# Altium schematic sheet GS_01_Pow.SchDoc: Title
size A3; Date: Date; CompanyName: Integrated Micro-Electronics Bulgaria; Organization: Design & Development Department; Address1: Drawing Type; Address2: Address 1; Address3: Address 2; Address4: Address 3; DocumentNumber: 730xxx; Revision: 01; SheetNumber: 1; SheetTotal: 1; PageSetup: Record=PageOptions|CenterHorizontal=True|CenterVertical=True|PrintScale=0.70|XCorrection=1.00|YCorrection=1.00|PrintKind=2|BorderSize=5000000|LeftOffset=0|BottomOffset=0|Orientation=2|PaperLength=1000|PaperWidth=1000|Scale=100|PaperSource=7|PrintQuality=-4|MediaType=1|DitherType=10|PaperKind=A4|PrintScaleMode=1; SheetSize: A3; Time: Time; ModifiedDate: Mod. Date
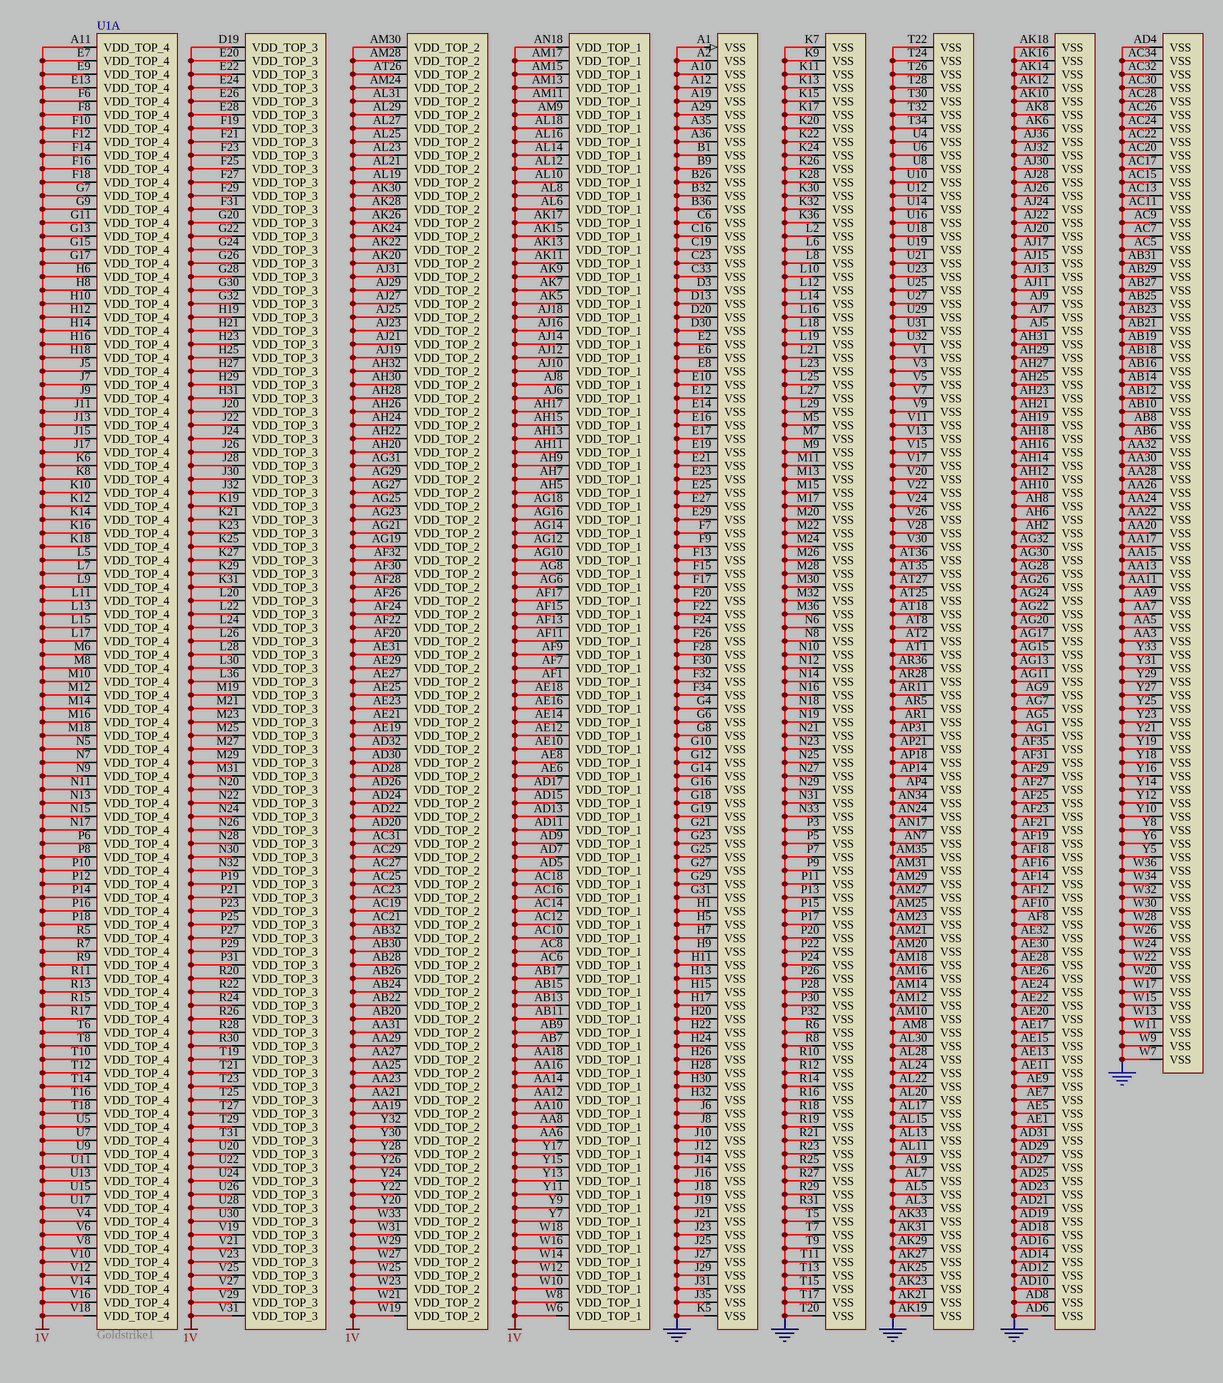
[diagram p0: GS_01_Pow.SchDoc]

## Parts
U1  Goldstrike1  (part A of 5)

## Nets
1V: U1.A11(VDD_TOP_4) U1.AA6(VDD_TOP_1) U1.AA8(VDD_TOP_1) U1.AA10(VDD_TOP_1) U1.AA12(VDD_TOP_1) U1.AA14(VDD_TOP_1) U1.AA16(VDD_TOP_1) U1.AA18(VDD_TOP_1) U1.AA19(VDD_TOP_2) U1.AA21(VDD_TOP_2) U1.AA23(VDD_TOP_2) U1.AA25(VDD_TOP_2) U1.AA27(VDD_TOP_2) U1.AA29(VDD_TOP_2) U1.AA31(VDD_TOP_2) U1.AB7(VDD_TOP_1) U1.AB9(VDD_TOP_1) U1.AB11(VDD_TOP_1) U1.AB13(VDD_TOP_1) U1.AB15(VDD_TOP_1) U1.AB17(VDD_TOP_1) U1.AB20(VDD_TOP_2) U1.AB22(VDD_TOP_2) U1.AB24(VDD_TOP_2) U1.AB26(VDD_TOP_2) U1.AB28(VDD_TOP_2) U1.AB30(VDD_TOP_2) U1.AB32(VDD_TOP_2) U1.AC6(VDD_TOP_1) U1.AC8(VDD_TOP_1) U1.AC10(VDD_TOP_1) U1.AC12(VDD_TOP_1) U1.AC14(VDD_TOP_1) U1.AC16(VDD_TOP_1) U1.AC18(VDD_TOP_1) U1.AC19(VDD_TOP_2) U1.AC21(VDD_TOP_2) U1.AC23(VDD_TOP_2) U1.AC25(VDD_TOP_2) U1.AC27(VDD_TOP_2) U1.AC29(VDD_TOP_2) U1.AC31(VDD_TOP_2) U1.AD5(VDD_TOP_1) U1.AD7(VDD_TOP_1) U1.AD9(VDD_TOP_1) U1.AD11(VDD_TOP_1) U1.AD13(VDD_TOP_1) U1.AD15(VDD_TOP_1) U1.AD17(VDD_TOP_1) U1.AD20(VDD_TOP_2) U1.AD22(VDD_TOP_2) U1.AD24(VDD_TOP_2) U1.AD26(VDD_TOP_2) U1.AD28(VDD_TOP_2) U1.AD30(VDD_TOP_2) U1.AD32(VDD_TOP_2) U1.AE6(VDD_TOP_1) U1.AE8(VDD_TOP_1) U1.AE10(VDD_TOP_1) U1.AE12(VDD_TOP_1) U1.AE14(VDD_TOP_1) U1.AE16(VDD_TOP_1) U1.AE18(VDD_TOP_1) U1.AE19(VDD_TOP_2) U1.AE21(VDD_TOP_2) U1.AE23(VDD_TOP_2) U1.AE25(VDD_TOP_2) U1.AE27(VDD_TOP_2) U1.AE29(VDD_TOP_2) U1.AE31(VDD_TOP_2) U1.AF1(VDD_TOP_1) U1.AF7(VDD_TOP_1) U1.AF9(VDD_TOP_1) U1.AF11(VDD_TOP_1) U1.AF13(VDD_TOP_1) U1.AF15(VDD_TOP_1) U1.AF17(VDD_TOP_1) U1.AF20(VDD_TOP_2) U1.AF22(VDD_TOP_2) U1.AF24(VDD_TOP_2) U1.AF26(VDD_TOP_2) U1.AF28(VDD_TOP_2) U1.AF30(VDD_TOP_2) U1.AF32(VDD_TOP_2) U1.AG6(VDD_TOP_1) U1.AG8(VDD_TOP_1) U1.AG10(VDD_TOP_1) U1.AG12(VDD_TOP_1) U1.AG14(VDD_TOP_1) U1.AG16(VDD_TOP_1) U1.AG18(VDD_TOP_1) U1.AG19(VDD_TOP_2) U1.AG21(VDD_TOP_2) U1.AG23(VDD_TOP_2) U1.AG25(VDD_TOP_2) U1.AG27(VDD_TOP_2) U1.AG29(VDD_TOP_2) U1.AG31(VDD_TOP_2) U1.AH5(VDD_TOP_1) U1.AH7(VDD_TOP_1) U1.AH9(VDD_TOP_1) U1.AH11(VDD_TOP_1) U1.AH13(VDD_TOP_1) U1.AH15(VDD_TOP_1) U1.AH17(VDD_TOP_1) U1.AH20(VDD_TOP_2) U1.AH22(VDD_TOP_2) U1.AH24(VDD_TOP_2) U1.AH26(VDD_TOP_2) U1.AH28(VDD_TOP_2) U1.AH30(VDD_TOP_2) U1.AH32(VDD_TOP_2) U1.AJ6(VDD_TOP_1) U1.AJ8(VDD_TOP_1) U1.AJ10(VDD_TOP_1) U1.AJ12(VDD_TOP_1) U1.AJ14(VDD_TOP_1) U1.AJ16(VDD_TOP_1) U1.AJ18(VDD_TOP_1) U1.AJ19(VDD_TOP_2) U1.AJ21(VDD_TOP_2) U1.AJ23(VDD_TOP_2) U1.AJ25(VDD_TOP_2) U1.AJ27(VDD_TOP_2) U1.AJ29(VDD_TOP_2) U1.AJ31(VDD_TOP_2) U1.AK5(VDD_TOP_1) U1.AK7(VDD_TOP_1) U1.AK9(VDD_TOP_1) U1.AK11(VDD_TOP_1) U1.AK13(VDD_TOP_1) U1.AK15(VDD_TOP_1) U1.AK17(VDD_TOP_1) U1.AK20(VDD_TOP_2) U1.AK22(VDD_TOP_2) U1.AK24(VDD_TOP_2) U1.AK26(VDD_TOP_2) U1.AK28(VDD_TOP_2) U1.AK30(VDD_TOP_2) U1.AL6(VDD_TOP_1) U1.AL8(VDD_TOP_1) U1.AL10(VDD_TOP_1) U1.AL12(VDD_TOP_1) U1.AL14(VDD_TOP_1) U1.AL16(VDD_TOP_1) U1.AL18(VDD_TOP_1) U1.AL19(VDD_TOP_2) U1.AL21(VDD_TOP_2) U1.AL23(VDD_TOP_2) U1.AL25(VDD_TOP_2) U1.AL27(VDD_TOP_2) U1.AL29(VDD_TOP_2) U1.AL31(VDD_TOP_2) U1.AM9(VDD_TOP_1) U1.AM11(VDD_TOP_1) U1.AM13(VDD_TOP_1) U1.AM15(VDD_TOP_1) U1.AM17(VDD_TOP_1) U1.AM24(VDD_TOP_2) U1.AM28(VDD_TOP_2) U1.AM30(VDD_TOP_2) U1.AN18(VDD_TOP_1) U1.AT26(VDD_TOP_2) U1.D19(VDD_TOP_3) U1.E7(VDD_TOP_4) U1.E9(VDD_TOP_4) U1.E13(VDD_TOP_4) U1.E20(VDD_TOP_3) U1.E22(VDD_TOP_3) U1.E24(VDD_TOP_3) U1.E26(VDD_TOP_3) U1.E28(VDD_TOP_3) U1.F6(VDD_TOP_4) U1.F8(VDD_TOP_4) U1.F10(VDD_TOP_4) U1.F12(VDD_TOP_4) U1.F14(VDD_TOP_4) U1.F16(VDD_TOP_4) U1.F18(VDD_TOP_4) U1.F19(VDD_TOP_3) U1.F21(VDD_TOP_3) U1.F23(VDD_TOP_3) U1.F25(VDD_TOP_3) U1.F27(VDD_TOP_3) U1.F29(VDD_TOP_3) U1.F31(VDD_TOP_3) U1.G7(VDD_TOP_4) U1.G9(VDD_TOP_4) U1.G11(VDD_TOP_4) U1.G13(VDD_TOP_4) U1.G15(VDD_TOP_4) U1.G17(VDD_TOP_4) U1.G20(VDD_TOP_3) U1.G22(VDD_TOP_3) U1.G24(VDD_TOP_3) U1.G26(VDD_TOP_3) U1.G28(VDD_TOP_3) U1.G30(VDD_TOP_3) U1.G32(VDD_TOP_3) U1.H6(VDD_TOP_4) U1.H8(VDD_TOP_4) U1.H10(VDD_TOP_4) U1.H12(VDD_TOP_4) U1.H14(VDD_TOP_4) U1.H16(VDD_TOP_4) U1.H18(VDD_TOP_4) U1.H19(VDD_TOP_3) U1.H21(VDD_TOP_3) U1.H23(VDD_TOP_3) U1.H25(VDD_TOP_3) U1.H27(VDD_TOP_3) U1.H29(VDD_TOP_3) U1.H31(VDD_TOP_3) U1.J5(VDD_TOP_4) U1.J7(VDD_TOP_4) U1.J9(VDD_TOP_4) U1.J11(VDD_TOP_4) U1.J13(VDD_TOP_4) U1.J15(VDD_TOP_4) U1.J17(VDD_TOP_4) U1.J20(VDD_TOP_3) U1.J22(VDD_TOP_3) U1.J24(VDD_TOP_3) U1.J26(VDD_TOP_3) U1.J28(VDD_TOP_3) U1.J30(VDD_TOP_3) U1.J32(VDD_TOP_3) U1.K6(VDD_TOP_4) U1.K8(VDD_TOP_4) U1.K10(VDD_TOP_4) U1.K12(VDD_TOP_4) U1.K14(VDD_TOP_4) U1.K16(VDD_TOP_4) U1.K18(VDD_TOP_4) U1.K19(VDD_TOP_3) U1.K21(VDD_TOP_3) U1.K23(VDD_TOP_3) U1.K25(VDD_TOP_3) U1.K27(VDD_TOP_3) U1.K29(VDD_TOP_3) U1.K31(VDD_TOP_3) U1.L5(VDD_TOP_4) U1.L7(VDD_TOP_4) U1.L9(VDD_TOP_4) U1.L11(VDD_TOP_4) U1.L13(VDD_TOP_4) U1.L15(VDD_TOP_4) U1.L17(VDD_TOP_4) U1.L20(VDD_TOP_3) U1.L22(VDD_TOP_3) U1.L24(VDD_TOP_3) U1.L26(VDD_TOP_3) U1.L28(VDD_TOP_3) U1.L30(VDD_TOP_3) U1.L36(VDD_TOP_3) U1.M6(VDD_TOP_4) U1.M8(VDD_TOP_4) U1.M10(VDD_TOP_4) U1.M12(VDD_TOP_4) U1.M14(VDD_TOP_4) U1.M16(VDD_TOP_4) U1.M18(VDD_TOP_4) U1.M19(VDD_TOP_3) U1.M21(VDD_TOP_3) U1.M23(VDD_TOP_3) U1.M25(VDD_TOP_3) U1.M27(VDD_TOP_3) U1.M29(VDD_TOP_3) U1.M31(VDD_TOP_3) U1.N5(VDD_TOP_4) U1.N7(VDD_TOP_4) U1.N9(VDD_TOP_4) U1.N11(VDD_TOP_4) U1.N13(VDD_TOP_4) U1.N15(VDD_TOP_4) U1.N17(VDD_TOP_4) U1.N20(VDD_TOP_3) U1.N22(VDD_TOP_3) U1.N24(VDD_TOP_3) U1.N26(VDD_TOP_3) U1.N28(VDD_TOP_3) U1.N30(VDD_TOP_3) U1.N32(VDD_TOP_3) U1.P6(VDD_TOP_4) U1.P8(VDD_TOP_4) U1.P10(VDD_TOP_4) U1.P12(VDD_TOP_4) U1.P14(VDD_TOP_4) U1.P16(VDD_TOP_4) U1.P18(VDD_TOP_4) U1.P19(VDD_TOP_3) U1.P21(VDD_TOP_3) U1.P23(VDD_TOP_3) U1.P25(VDD_TOP_3) U1.P27(VDD_TOP_3) U1.P29(VDD_TOP_3) U1.P31(VDD_TOP_3) U1.R5(VDD_TOP_4) U1.R7(VDD_TOP_4) U1.R9(VDD_TOP_4) U1.R11(VDD_TOP_4) U1.R13(VDD_TOP_4) U1.R15(VDD_TOP_4) U1.R17(VDD_TOP_4) U1.R20(VDD_TOP_3) U1.R22(VDD_TOP_3) U1.R24(VDD_TOP_3) U1.R26(VDD_TOP_3) U1.R28(VDD_TOP_3) U1.R30(VDD_TOP_3) U1.T6(VDD_TOP_4) U1.T8(VDD_TOP_4) U1.T10(VDD_TOP_4) U1.T12(VDD_TOP_4) U1.T14(VDD_TOP_4) U1.T16(VDD_TOP_4) U1.T18(VDD_TOP_4) U1.T19(VDD_TOP_3) U1.T21(VDD_TOP_3) U1.T23(VDD_TOP_3) U1.T25(VDD_TOP_3) U1.T27(VDD_TOP_3) U1.T29(VDD_TOP_3) U1.T31(VDD_TOP_3) U1.U5(VDD_TOP_4) U1.U7(VDD_TOP_4) U1.U9(VDD_TOP_4) U1.U11(VDD_TOP_4) U1.U13(VDD_TOP_4) U1.U15(VDD_TOP_4) U1.U17(VDD_TOP_4) U1.U20(VDD_TOP_3) U1.U22(VDD_TOP_3) U1.U24(VDD_TOP_3) U1.U26(VDD_TOP_3) U1.U28(VDD_TOP_3) U1.U30(VDD_TOP_3) U1.V4(VDD_TOP_4) U1.V6(VDD_TOP_4) U1.V8(VDD_TOP_4) U1.V10(VDD_TOP_4) U1.V12(VDD_TOP_4) U1.V14(VDD_TOP_4) U1.V16(VDD_TOP_4) U1.V18(VDD_TOP_4) U1.V19(VDD_TOP_3) U1.V21(VDD_TOP_3) U1.V23(VDD_TOP_3) U1.V25(VDD_TOP_3) U1.V27(VDD_TOP_3) U1.V29(VDD_TOP_3) U1.V31(VDD_TOP_3) U1.W6(VDD_TOP_1) U1.W8(VDD_TOP_1) U1.W10(VDD_TOP_1) U1.W12(VDD_TOP_1) U1.W14(VDD_TOP_1) U1.W16(VDD_TOP_1) U1.W18(VDD_TOP_1) U1.W19(VDD_TOP_2) U1.W21(VDD_TOP_2) U1.W23(VDD_TOP_2) U1.W25(VDD_TOP_2) U1.W27(VDD_TOP_2) U1.W29(VDD_TOP_2) U1.W31(VDD_TOP_2) U1.W33(VDD_TOP_2) U1.Y7(VDD_TOP_1) U1.Y9(VDD_TOP_1) U1.Y11(VDD_TOP_1) U1.Y13(VDD_TOP_1) U1.Y15(VDD_TOP_1) U1.Y17(VDD_TOP_1) U1.Y20(VDD_TOP_2) U1.Y22(VDD_TOP_2) U1.Y24(VDD_TOP_2) U1.Y26(VDD_TOP_2) U1.Y28(VDD_TOP_2) U1.Y30(VDD_TOP_2) U1.Y32(VDD_TOP_2)
GND: U1.A1(VSS) U1.A2(VSS) U1.A10(VSS) U1.A12(VSS) U1.A19(VSS) U1.A29(VSS) U1.A35(VSS) U1.A36(VSS) U1.AA3(VSS) U1.AA5(VSS) U1.AA7(VSS) U1.AA9(VSS) U1.AA11(VSS) U1.AA13(VSS) U1.AA15(VSS) U1.AA17(VSS) U1.AA20(VSS) U1.AA22(VSS) U1.AA24(VSS) U1.AA26(VSS) U1.AA28(VSS) U1.AA30(VSS) U1.AA32(VSS) U1.AB6(VSS) U1.AB8(VSS) U1.AB10(VSS) U1.AB12(VSS) U1.AB14(VSS) U1.AB16(VSS) U1.AB18(VSS) U1.AB19(VSS) U1.AB21(VSS) U1.AB23(VSS) U1.AB25(VSS) U1.AB27(VSS) U1.AB29(VSS) U1.AB31(VSS) U1.AC5(VSS) U1.AC7(VSS) U1.AC9(VSS) U1.AC11(VSS) U1.AC13(VSS) U1.AC15(VSS) U1.AC17(VSS) U1.AC20(VSS) U1.AC22(VSS) U1.AC24(VSS) U1.AC26(VSS) U1.AC28(VSS) U1.AC30(VSS) U1.AC32(VSS) U1.AC34(VSS) U1.AD4(VSS) U1.AD6(VSS) U1.AD8(VSS) U1.AD10(VSS) U1.AD12(VSS) U1.AD14(VSS) U1.AD16(VSS) U1.AD18(VSS) U1.AD19(VSS) U1.AD21(VSS) U1.AD23(VSS) U1.AD25(VSS) U1.AD27(VSS) U1.AD29(VSS) U1.AD31(VSS) U1.AE1(VSS) U1.AE5(VSS) U1.AE7(VSS) U1.AE9(VSS) U1.AE11(VSS) U1.AE13(VSS) U1.AE15(VSS) U1.AE17(VSS) U1.AE20(VSS) U1.AE22(VSS) U1.AE24(VSS) U1.AE26(VSS) U1.AE28(VSS) U1.AE30(VSS) U1.AE32(VSS) U1.AF8(VSS) U1.AF10(VSS) U1.AF12(VSS) U1.AF14(VSS) U1.AF16(VSS) U1.AF18(VSS) U1.AF19(VSS) U1.AF21(VSS) U1.AF23(VSS) U1.AF25(VSS) U1.AF27(VSS) U1.AF29(VSS) U1.AF31(VSS) U1.AF35(VSS) U1.AG1(VSS) U1.AG5(VSS) U1.AG7(VSS) U1.AG9(VSS) U1.AG11(VSS) U1.AG13(VSS) U1.AG15(VSS) U1.AG17(VSS) U1.AG20(VSS) U1.AG22(VSS) U1.AG24(VSS) U1.AG26(VSS) U1.AG28(VSS) U1.AG30(VSS) U1.AG32(VSS) U1.AH2(VSS) U1.AH6(VSS) U1.AH8(VSS) U1.AH10(VSS) U1.AH12(VSS) U1.AH14(VSS) U1.AH16(VSS) U1.AH18(VSS) U1.AH19(VSS) U1.AH21(VSS) U1.AH23(VSS) U1.AH25(VSS) U1.AH27(VSS) U1.AH29(VSS) U1.AH31(VSS) U1.AJ5(VSS) U1.AJ7(VSS) U1.AJ9(VSS) U1.AJ11(VSS) U1.AJ13(VSS) U1.AJ15(VSS) U1.AJ17(VSS) U1.AJ20(VSS) U1.AJ22(VSS) U1.AJ24(VSS) U1.AJ26(VSS) U1.AJ28(VSS) U1.AJ30(VSS) U1.AJ32(VSS) U1.AJ36(VSS) U1.AK6(VSS) U1.AK8(VSS) U1.AK10(VSS) U1.AK12(VSS) U1.AK14(VSS) U1.AK16(VSS) U1.AK18(VSS) U1.AK19(VSS) U1.AK21(VSS) U1.AK23(VSS) U1.AK25(VSS) U1.AK27(VSS) U1.AK29(VSS) U1.AK31(VSS) U1.AK33(VSS) U1.AL3(VSS) U1.AL5(VSS) U1.AL7(VSS) U1.AL9(VSS) U1.AL11(VSS) U1.AL13(VSS) U1.AL15(VSS) U1.AL17(VSS) U1.AL20(VSS) U1.AL22(VSS) U1.AL24(VSS) U1.AL28(VSS) U1.AL30(VSS) U1.AM8(VSS) U1.AM10(VSS) U1.AM12(VSS) U1.AM14(VSS) U1.AM16(VSS) U1.AM18(VSS) U1.AM20(VSS) U1.AM21(VSS) U1.AM23(VSS) U1.AM25(VSS) U1.AM27(VSS) U1.AM29(VSS) U1.AM31(VSS) U1.AM35(VSS) U1.AN7(VSS) U1.AN17(VSS) U1.AN24(VSS) U1.AN34(VSS) U1.AP4(VSS) U1.AP14(VSS) U1.AP18(VSS) U1.AP21(VSS) U1.AP31(VSS) U1.AR1(VSS) U1.AR5(VSS) U1.AR11(VSS) U1.AR28(VSS) U1.AR36(VSS) U1.AT1(VSS) U1.AT2(VSS) U1.AT8(VSS) U1.AT18(VSS) U1.AT25(VSS) U1.AT27(VSS) U1.AT35(VSS) U1.AT36(VSS) U1.B1(VSS) U1.B9(VSS) U1.B26(VSS) U1.B32(VSS) U1.B36(VSS) U1.C6(VSS) U1.C16(VSS) U1.C19(VSS) U1.C23(VSS) U1.C33(VSS) U1.D3(VSS) U1.D13(VSS) U1.D20(VSS) U1.D30(VSS) U1.E2(VSS) U1.E6(VSS) U1.E8(VSS) U1.E10(VSS) U1.E12(VSS) U1.E14(VSS) U1.E16(VSS) U1.E17(VSS) U1.E19(VSS) U1.E21(VSS) U1.E23(VSS) U1.E25(VSS) U1.E27(VSS) U1.E29(VSS) U1.F7(VSS) U1.F9(VSS) U1.F13(VSS) U1.F15(VSS) U1.F17(VSS) U1.F20(VSS) U1.F22(VSS) U1.F24(VSS) U1.F26(VSS) U1.F28(VSS) U1.F30(VSS) U1.F32(VSS) U1.F34(VSS) U1.G4(VSS) U1.G6(VSS) U1.G8(VSS) U1.G10(VSS) U1.G12(VSS) U1.G14(VSS) U1.G16(VSS) U1.G18(VSS) U1.G19(VSS) U1.G21(VSS) U1.G23(VSS) U1.G25(VSS) U1.G27(VSS) U1.G29(VSS) U1.G31(VSS) U1.H1(VSS) U1.H5(VSS) U1.H7(VSS) U1.H9(VSS) U1.H11(VSS) U1.H13(VSS) U1.H15(VSS) U1.H17(VSS) U1.H20(VSS) U1.H22(VSS) U1.H24(VSS) U1.H26(VSS) U1.H28(VSS) U1.H30(VSS) U1.H32(VSS) U1.J6(VSS) U1.J8(VSS) U1.J10(VSS) U1.J12(VSS) U1.J14(VSS) U1.J16(VSS) U1.J18(VSS) U1.J19(VSS) U1.J21(VSS) U1.J23(VSS) U1.J25(VSS) U1.J27(VSS) U1.J29(VSS) U1.J31(VSS) U1.J35(VSS) U1.K5(VSS) U1.K7(VSS) U1.K9(VSS) U1.K11(VSS) U1.K13(VSS) U1.K15(VSS) U1.K17(VSS) U1.K20(VSS) U1.K22(VSS) U1.K24(VSS) U1.K26(VSS) U1.K28(VSS) U1.K30(VSS) U1.K32(VSS) U1.K36(VSS) U1.L2(VSS) U1.L6(VSS) U1.L8(VSS) U1.L10(VSS) U1.L12(VSS) U1.L14(VSS) U1.L16(VSS) U1.L18(VSS) U1.L19(VSS) U1.L21(VSS) U1.L23(VSS) U1.L25(VSS) U1.L27(VSS) U1.L29(VSS) U1.M5(VSS) U1.M7(VSS) U1.M9(VSS) U1.M11(VSS) U1.M13(VSS) U1.M15(VSS) U1.M17(VSS) U1.M20(VSS) U1.M22(VSS) U1.M24(VSS) U1.M26(VSS) U1.M28(VSS) U1.M30(VSS) U1.M32(VSS) U1.M36(VSS) U1.N6(VSS) U1.N8(VSS) U1.N10(VSS) U1.N12(VSS) U1.N14(VSS) U1.N16(VSS) U1.N18(VSS) U1.N19(VSS) U1.N21(VSS) U1.N23(VSS) U1.N25(VSS) U1.N27(VSS) U1.N29(VSS) U1.N31(VSS) U1.N33(VSS) U1.P3(VSS) U1.P5(VSS) U1.P7(VSS) U1.P9(VSS) U1.P11(VSS) U1.P13(VSS) U1.P15(VSS) U1.P17(VSS) U1.P20(VSS) U1.P22(VSS) U1.P24(VSS) U1.P26(VSS) U1.P28(VSS) U1.P30(VSS) U1.P32(VSS) U1.R6(VSS) U1.R8(VSS) U1.R10(VSS) U1.R12(VSS) U1.R14(VSS) U1.R16(VSS) U1.R18(VSS) U1.R19(VSS) U1.R21(VSS) U1.R23(VSS) U1.R25(VSS) U1.R27(VSS) U1.R29(VSS) U1.R31(VSS) U1.T5(VSS) U1.T7(VSS) U1.T9(VSS) U1.T11(VSS) U1.T13(VSS) U1.T15(VSS) U1.T17(VSS) U1.T20(VSS) U1.T22(VSS) U1.T24(VSS) U1.T26(VSS) U1.T28(VSS) U1.T30(VSS) U1.T32(VSS) U1.T34(VSS) U1.U4(VSS) U1.U6(VSS) U1.U8(VSS) U1.U10(VSS) U1.U12(VSS) U1.U14(VSS) U1.U16(VSS) U1.U18(VSS) U1.U19(VSS) U1.U21(VSS) U1.U23(VSS) U1.U25(VSS) U1.U27(VSS) U1.U29(VSS) U1.U31(VSS) U1.U32(VSS) U1.V1(VSS) U1.V3(VSS) U1.V5(VSS) U1.V7(VSS) U1.V9(VSS) U1.V11(VSS) U1.V13(VSS) U1.V15(VSS) U1.V17(VSS) U1.V20(VSS) U1.V22(VSS) U1.V24(VSS) U1.V26(VSS) U1.V28(VSS) U1.V30(VSS) U1.W7(VSS) U1.W9(VSS) U1.W11(VSS) U1.W13(VSS) U1.W15(VSS) U1.W17(VSS) U1.W20(VSS) U1.W22(VSS) U1.W24(VSS) U1.W26(VSS) U1.W28(VSS) U1.W30(VSS) U1.W32(VSS) U1.W34(VSS) U1.W36(VSS) U1.Y5(VSS) U1.Y6(VSS) U1.Y8(VSS) U1.Y10(VSS) U1.Y12(VSS) U1.Y14(VSS) U1.Y16(VSS) U1.Y18(VSS) U1.Y19(VSS) U1.Y21(VSS) U1.Y23(VSS) U1.Y25(VSS) U1.Y27(VSS) U1.Y29(VSS) U1.Y31(VSS) U1.Y33(VSS)

## Notes on the sheet
- Block Name
- Document Type: Schematic
- Size
- File Name
- Variant
- Rev.
- Project Name
- Sheet
- /